# Altium schematic sheet FLEX_TOP_MOSFETS.SchDoc
size A3
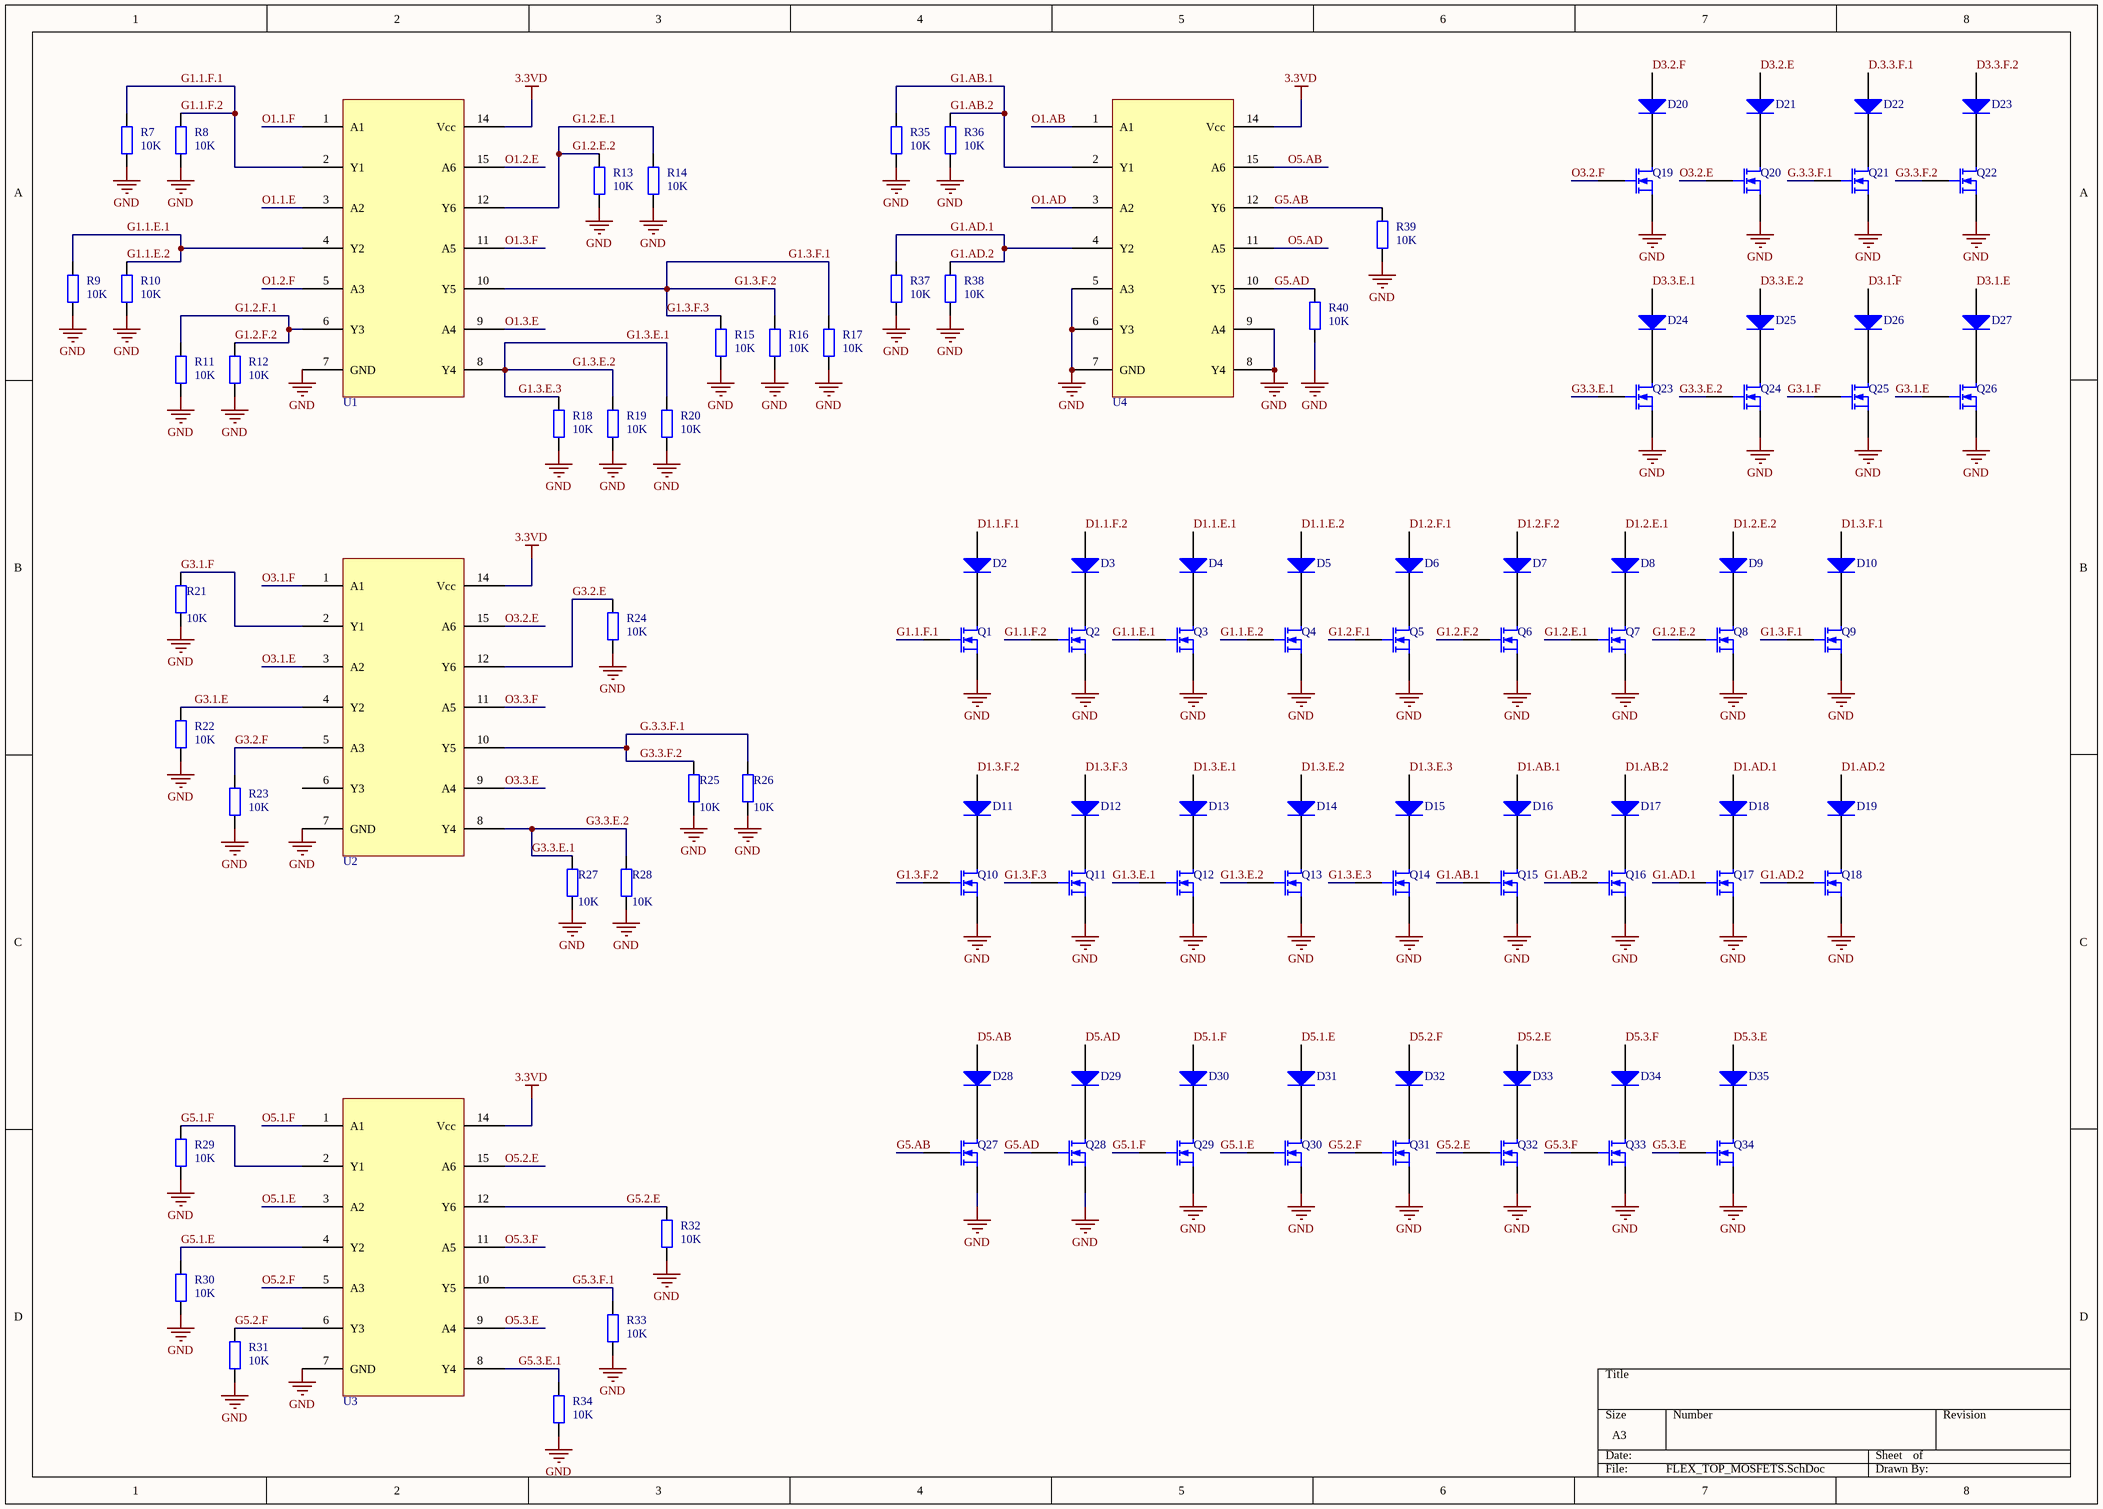
[diagram p0: FLEX_TOP_MOSFETS.SchDoc]

## Parts
D2  de  [Diode_Shottky]  (value not drawn)
D3  de  [Diode_Shottky]  (value not drawn)
D4  de  [Diode_Shottky]  (value not drawn)
D5  de  [Diode_Shottky]  (value not drawn)
D6  de  [Diode_Shottky]  (value not drawn)
D7  de  [Diode_Shottky]  (value not drawn)
D8  de  [Diode_Shottky]  (value not drawn)
D9  de  [Diode_Shottky]  (value not drawn)
D10  de  [Diode_Shottky]  (value not drawn)
D11  de  [Diode_Shottky]  (value not drawn)
D12  de  [Diode_Shottky]  (value not drawn)
D13  de  [Diode_Shottky]  (value not drawn)
D14  de  [Diode_Shottky]  (value not drawn)
D15  de  [Diode_Shottky]  (value not drawn)
D16  de  [Diode_Shottky]  (value not drawn)
D17  de  [Diode_Shottky]  (value not drawn)
D18  de  [Diode_Shottky]  (value not drawn)
D19  de  [Diode_Shottky]  (value not drawn)
D20  de  [Diode_Shottky]  (value not drawn)
D21  de  [Diode_Shottky]  (value not drawn)
D22  de  [Diode_Shottky]  (value not drawn)
D23  de  [Diode_Shottky]  (value not drawn)
D24  de  [Diode_Shottky]  (value not drawn)
D25  de  [Diode_Shottky]  (value not drawn)
D26  de  [Diode_Shottky]  (value not drawn)
D27  de  [Diode_Shottky]  (value not drawn)
D28  de  [Diode_Shottky]  (value not drawn)
D29  de  [Diode_Shottky]  (value not drawn)
D30  de  [Diode_Shottky]  (value not drawn)
D31  de  [Diode_Shottky]  (value not drawn)
D32  de  [Diode_Shottky]  (value not drawn)
D33  de  [Diode_Shottky]  (value not drawn)
D34  de  [Diode_Shottky]  (value not drawn)
D35  de  [Diode_Shottky]  (value not drawn)
Q1  (no value)  [MOSFET]
Q2  (no value)  [MOSFET]
Q3  (no value)  [MOSFET]
Q4  (no value)  [MOSFET]
Q5  (no value)  [MOSFET]
Q6  (no value)  [MOSFET]
Q7  (no value)  [MOSFET]
Q8  (no value)  [MOSFET]
Q9  (no value)  [MOSFET]
Q10  (no value)  [MOSFET]
Q11  (no value)  [MOSFET]
Q12  (no value)  [MOSFET]
Q13  (no value)  [MOSFET]
Q14  (no value)  [MOSFET]
Q15  (no value)  [MOSFET]
Q16  (no value)  [MOSFET]
Q17  (no value)  [MOSFET]
Q18  (no value)  [MOSFET]
Q19  (no value)  [MOSFET]
Q20  (no value)  [MOSFET]
Q21  (no value)  [MOSFET]
Q22  (no value)  [MOSFET]
Q23  (no value)  [MOSFET]
Q24  (no value)  [MOSFET]
Q25  (no value)  [MOSFET]
Q26  (no value)  [MOSFET]
Q27  (no value)  [MOSFET]
Q28  (no value)  [MOSFET]
Q29  (no value)  [MOSFET]
Q30  (no value)  [MOSFET]
Q31  (no value)  [MOSFET]
Q32  (no value)  [MOSFET]
Q33  (no value)  [MOSFET]
Q34  (no value)  [MOSFET]
R7  value 10K  [Panasonic ERJ-Series (1608)]
R8  value 10K  [Panasonic ERJ-Series (1608)]
R9  value 10K  [Panasonic ERJ-Series (1608)]
R10  value 10K  [Panasonic ERJ-Series (1608)]
R11  value 10K  [Panasonic ERJ-Series (1608)]
R12  value 10K  [Panasonic ERJ-Series (1608)]
R13  value 10K  [Panasonic ERJ-Series (1608)]
R14  value 10K  [Panasonic ERJ-Series (1608)]
R15  value 10K  [Panasonic ERJ-Series (1608)]
R16  value 10K  [Panasonic ERJ-Series (1608)]
R17  value 10K  [Panasonic ERJ-Series (1608)]
R18  value 10K  [Panasonic ERJ-Series (1608)]
R19  value 10K  [Panasonic ERJ-Series (1608)]
R20  value 10K  [Panasonic ERJ-Series (1608)]
R21  value 10K  [Panasonic ERJ-Series (1608)]
R22  value 10K  [Panasonic ERJ-Series (1608)]
R23  value 10K  [Panasonic ERJ-Series (1608)]
R24  value 10K  [Panasonic ERJ-Series (1608)]
R25  value 10K  [Panasonic ERJ-Series (1608)]
R26  value 10K  [Panasonic ERJ-Series (1608)]
R27  value 10K  [Panasonic ERJ-Series (1608)]
R28  value 10K  [Panasonic ERJ-Series (1608)]
R29  value 10K  [Panasonic ERJ-Series (1608)]
R30  value 10K  [Panasonic ERJ-Series (1608)]
R31  value 10K  [Panasonic ERJ-Series (1608)]
R32  value 10K  [Panasonic ERJ-Series (1608)]
R33  value 10K  [Panasonic ERJ-Series (1608)]
R34  value 10K  [Panasonic ERJ-Series (1608)]
R35  value 10K  [Panasonic ERJ-Series (1608)]
R36  value 10K  [Panasonic ERJ-Series (1608)]
R37  value 10K  [Panasonic ERJ-Series (1608)]
R38  value 10K  [Panasonic ERJ-Series (1608)]
R39  value 10K  [Panasonic ERJ-Series (1608)]
R40  value 10K  [Panasonic ERJ-Series (1608)]
U1  MC74VHCT50A  (value not drawn)
U2  MC74VHCT50A  (value not drawn)
U3  MC74VHCT50A  (value not drawn)
U4  MC74VHCT50A  (value not drawn)

## Nets
3.3VD: U1.14(Vcc) U2.14(Vcc) U3.14(Vcc) U4.14(Vcc)
GND: Q1.3(S) Q2.3(S) Q3.3(S) Q4.3(S) Q5.3(S) Q6.3(S) Q7.3(S) Q8.3(S) Q9.3(S) Q10.3(S) Q11.3(S) Q12.3(S) Q13.3(S) Q14.3(S) Q15.3(S) Q16.3(S) Q17.3(S) Q18.3(S) Q19.3(S) Q20.3(S) Q21.3(S) Q22.3(S) Q23.3(S) Q24.3(S) Q25.3(S) Q26.3(S) Q27.3(S) Q28.3(S) Q29.3(S) Q30.3(S) Q31.3(S) Q32.3(S) Q33.3(S) Q34.3(S) R7.1 R8.1 R9.1 R10.1 R11.1 R12.1 R13.1 R14.1 R15.1 R16.1 R17.1 R18.1 R19.1 R20.1 R21.1 R22.1 R23.1 R24.1 R25.1 R26.1 R27.1 R28.1 R29.1 R30.1 R31.1 R32.1 R33.1 R34.1 R35.1 R36.1 R37.1 R38.1 R39.1 R40.1 U1.7(GND) U2.7(GND) U3.7(GND) U4.5(A3) U4.6(Y3) U4.7(GND) U4.8(Y4) U4.9(A4)
D1.1.E.1: D4.1(A)
D1.1.E.2: D5.1(A)
D1.1.F.1: D2.1(A)
D1.1.F.2: D3.1(A)
D1.2.E.1: D8.1(A)
D1.2.E.2: D9.1(A)
D1.2.F.1: D6.1(A)
D1.2.F.2: D7.1(A)
D1.3.E.1: D13.1(A)
D1.3.E.2: D14.1(A)
D1.3.E.3: D15.1(A)
D1.3.F.1: D10.1(A)
D1.3.F.2: D11.1(A)
D1.3.F.3: D12.1(A)
D1.AB.1: D16.1(A)
D1.AB.2: D17.1(A)
D1.AD.1: D18.1(A)
D1.AD.2: D19.1(A)
D3.1~{.}F: D26.1(A)
D3.1.E: D27.1(A)
D3.2.E: D21.1(A)
D3.2.F: D20.1(A)
D3.3.E.1: D24.1(A)
D3.3.E.2: D25.1(A)
D3.3.F.2: D23.1(A)
D5.1.E: D31.1(A)
D5.1.F: D30.1(A)
D5.2.E: D33.1(A)
D5.2.F: D32.1(A)
D5.3.E: D35.1(A)
D5.3.F: D34.1(A)
D5.AB: D28.1(A)
D5.AD: D29.1(A)
D.3.3.F.1: D22.1(A)
G1.1.E.1: Q3.2(G) Q4.2(G) R9.2 R10.2 U1.4(Y2)  [also labelled G1.1.E.2]
G1.1.F.1: Q1.2(G) Q2.2(G) R7.2 R8.2 U1.2(Y1)  [also labelled G1.1.F.2]
G1.2.E.1: Q7.2(G) Q8.2(G) R13.2 R14.2 U1.12(Y6)  [also labelled G1.2.E.2]
G1.2.F.1: Q5.2(G) Q6.2(G) R11.2 R12.2 U1.6(Y3)  [also labelled G1.2.F.2]
G1.3.E.1: Q12.2(G) Q13.2(G) Q14.2(G) R18.2 R19.2 R20.2 U1.8(Y4)  [also labelled G1.3.E.2, G1.3.E.3]
G1.3.F.1: Q9.2(G) Q10.2(G) Q11.2(G) R15.2 R16.2 R17.2 U1.10(Y5)  [also labelled G1.3.F.2, G1.3.F.3]
G1.AB.1: Q15.2(G) Q16.2(G) R35.2 R36.2 U4.2(Y1)  [also labelled G1.AB.2]
G1.AD.1: Q17.2(G) Q18.2(G) R37.2 R38.2 U4.4(Y2)  [also labelled G1.AD.2]
G3.1.E: Q26.2(G) R22.2 U2.4(Y2)
G3.1.F: Q25.2(G) R21.2 U2.2(Y1)
G3.2.E: R24.2 U2.12(Y6)
G3.2.F: R23.2 U2.5(A3)
G3.3.E.1: Q23.2(G) Q24.2(G) R27.2 R28.2 U2.8(Y4)  [also labelled G3.3.E.2]
G5.1.E: Q30.2(G) R30.2 U3.4(Y2)
G5.1.F: Q29.2(G) R29.2 U3.2(Y1)
G5.2.E: Q32.2(G) R32.2 U3.12(Y6)
G5.2.F: Q31.2(G) R31.2 U3.6(Y3)
G5.3.E: Q34.2(G)
G5.3.E.1: R34.2 U3.8(Y4)
G5.3.F: Q33.2(G)
G5.3.F.1: R33.2 U3.10(Y5)
G5.AB: Q27.2(G) R39.2 U4.12(Y6)
G5.AD: Q28.2(G) R40.2 U4.10(Y5)
G.3.3.F.1: Q21.2(G) Q22.2(G) R25.2 R26.2 U2.10(Y5)  [also labelled G3.3.F.2]
O1.1.E: U1.3(A2)
O1.1.F: U1.1(A1)
O1.2.E: U1.15(A6)
O1.2.F: U1.5(A3)
O1.3.E: U1.9(A4)
O1.3.F: U1.11(A5)
O1.AB: U4.1(A1)
O1.AD: U4.3(A2)
O3.1.E: U2.3(A2)
O3.1.F: U2.1(A1)
O3.2.E: Q20.2(G) U2.15(A6)
O3.2.F: Q19.2(G)
O3.3.E: U2.9(A4)
O3.3.F: U2.11(A5)
O5.1.E: U3.3(A2)
O5.1.F: U3.1(A1)
O5.2.E: U3.15(A6)
O5.2.F: U3.5(A3)
O5.3.E: U3.9(A4)
O5.3.F: U3.11(A5)
O5.AB: U4.15(A6)
O5.AD: U4.11(A5)
NetD2_2: D2.2(K) Q1.1(D)
NetD3_2: D3.2(K) Q2.1(D)
NetD4_2: D4.2(K) Q3.1(D)
NetD5_2: D5.2(K) Q4.1(D)
NetD6_2: D6.2(K) Q5.1(D)
NetD7_2: D7.2(K) Q6.1(D)
NetD8_2: D8.2(K) Q7.1(D)
NetD9_2: D9.2(K) Q8.1(D)
NetD10_2: D10.2(K) Q9.1(D)
NetD11_2: D11.2(K) Q10.1(D)
NetD12_2: D12.2(K) Q11.1(D)
NetD13_2: D13.2(K) Q12.1(D)
NetD14_2: D14.2(K) Q13.1(D)
NetD15_2: D15.2(K) Q14.1(D)
NetD16_2: D16.2(K) Q15.1(D)
NetD17_2: D17.2(K) Q16.1(D)
NetD18_2: D18.2(K) Q17.1(D)
NetD19_2: D19.2(K) Q18.1(D)
NetD20_2: D20.2(K) Q19.1(D)
NetD21_2: D21.2(K) Q20.1(D)
NetD22_2: D22.2(K) Q21.1(D)
NetD23_2: D23.2(K) Q22.1(D)
NetD24_2: D24.2(K) Q23.1(D)
NetD25_2: D25.2(K) Q24.1(D)
NetD26_2: D26.2(K) Q25.1(D)
NetD27_2: D27.2(K) Q26.1(D)
NetD28_2: D28.2(K) Q27.1(D)
NetD29_2: D29.2(K) Q28.1(D)
NetD30_2: D30.2(K) Q29.1(D)
NetD31_2: D31.2(K) Q30.1(D)
NetD32_2: D32.2(K) Q31.1(D)
NetD33_2: D33.2(K) Q32.1(D)
NetD34_2: D34.2(K) Q33.1(D)
NetD35_2: D35.2(K) Q34.1(D)

Not connected (* = marked no-connect by the designer): U2 6(Y3)

## Library data of the parts
D2-D35 = Diode: Default Diode; Published: 8-Jun-2000; LatestRevisionDate: 17-Jul-2002; LatestRevisionNote: Re-released for DXP Platform.; PackageVersion: Sep-1996; PackageReference: SMC; Publisher: Altium Limited; PackageDescription: DO-214-AB/SMC; 2 C-Bend Leads; Body 7.9 x 5.9 mm, inc. leads (LxW); Code_JEDEC: DO-214-AB; Supplier 1: Digi-Key; Supplier Part Number 1: 1727-5384-1-ND
Q1-Q34 = MOSFET-N: N-Channel MOSFET; Published: 8-Jun-2000; LatestRevisionDate: 17-Jul-2002; LatestRevisionNote: Re-released for DXP Platform.; PackageVersion: 1995/1996; PackageReference: E3; Publisher: Altium Limited; PackageDescription: TO, Flat Index; 3 In-Line, Axial Leads; Body Dia. 4.6mm; Lead Dia. 0.5 mm (max); Supplier 1: Digi-Key; Supplier 2: Digi-Key; Supplier Part Number 2: 497-7462-1-ND
R7-R40 = Res2: Resistor; Published: 8-Jun-2000; LatestRevisionDate: 17-Jul-2002; LatestRevisionNote: Re-released for DXP Platform.; PackageReference: AXIAL-0.4; Publisher: Altium Limited; PackageDescription: Axial Device, Thru-Hole; 2 Leads; 0.4 in Pin Spacing; Supplier 1: Digi-Key; Supplier 2: Digi-Key; Supplier Part Number 2: P10.0KHCT-ND
U1-U4 = MC74VHCT50A: 6-Channel CMOS Buffer